# Altium schematic sheet ADC.SchDoc
size A4
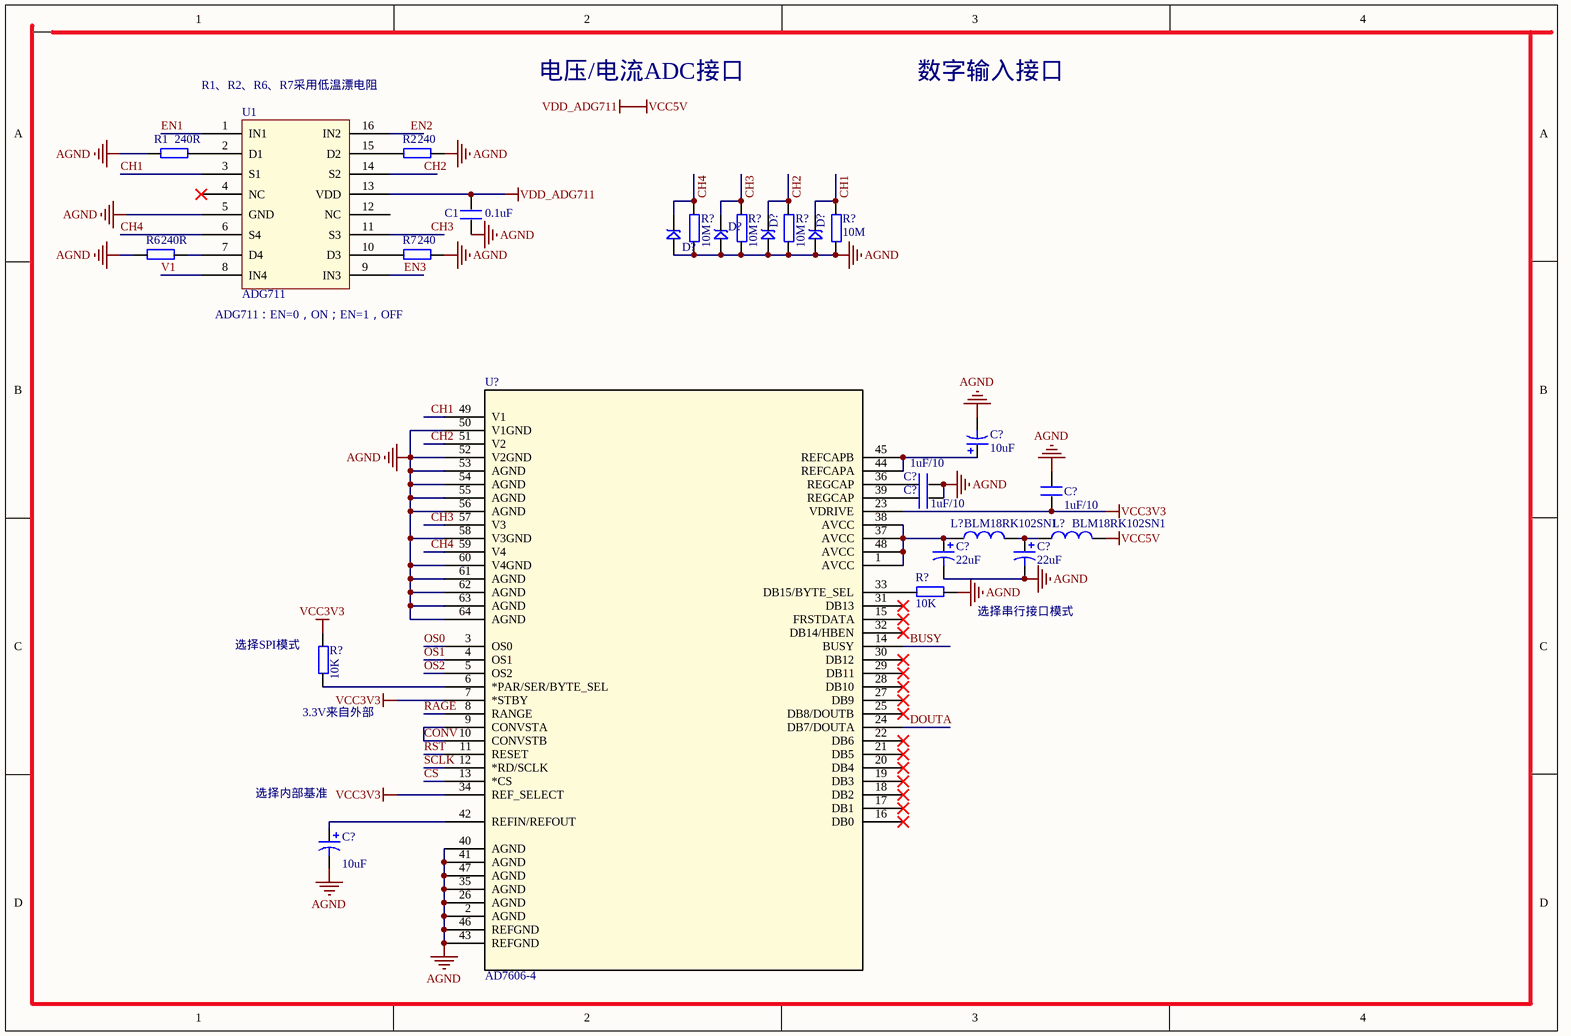
[diagram p0: ADC.SchDoc]

## Parts
(Parts that share a designator on the sheet are numbered #1, #2 ... from top to bottom, then left to right.)
C1  0.1uF  [0603]
C?#1  1uF/10  [0603]
C?#2  value 10uF  [CAP-3216]  (hidden comment: Cap Pol3)
C?#3  1uF/10  [0603]
C?#4  value 22uF  [CAP-3216]  (hidden comment: Cap Pol3)
C?#5  value 22uF  [CAP-3216]  (hidden comment: Cap Pol3)
C?#6  1uF/10  [0603]
C?#7  value 10uF  [CAP-3216]  (hidden comment: Cap Pol3)
D?#1  SMDJ 10CA  [SMC]  (value not drawn)
D?#2  SMDJ 10CA  [SMC]  (value not drawn)
D?#3  SMDJ 10CA  [SMC]  (value not drawn)
D?#4  SMDJ 10CA  [SMC]  (value not drawn)
L?#1  value BLM18RK102SN1  [0603-1]  (hidden comment: Inductor)
L?#2  value BLM18RK102SN1  [0603-1]  (hidden comment: Inductor)
R1  240R  [1206]
R2  240  [1206]
R6  240R  [1206]
R7  240  [1206]
R?#1  10M  [1206]
R?#2  10M  [1206]
R?#3  10M  [1206]
R?#4  10M  [1206]
R?#5  10K  [0603]
R?#6  10K  [0603]
U1  ADG711  [TSSOP16]
U?  AD7606-4  [ST_64_2]

## Nets
AGND: C1.1 C?#1.2 C?#2.2 C?#3.2 C?#4.2 C?#5.2 C?#6.2 C?#7.2 D?#1.1 D?#2.1 D?#3.1 D?#4.1 R1.2 R2.1 R6.2 R7.1 R?#1.1 R?#2.1 R?#3.1 R?#4.1 R?#5.1 U1.5(GND) U?.2(AGND) U?.26(AGND) U?.35(AGND) U?.40(AGND) U?.41(AGND) U?.43(REFGND) U?.46(REFGND) U?.47(AGND) U?.50(V1GND) U?.52(V2GND) U?.53(AGND) U?.54(AGND) U?.55(AGND) U?.56(AGND) U?.58(V3GND) U?.60(V4GND) U?.61(AGND) U?.62(AGND) U?.63(AGND) U?.64(AGND)
VCC3V3: C?#6.1 R?#6.2 U?.7(*STBY) U?.23(VDRIVE) U?.34(REF_SELECT)
VCC5V: C1.2 L?#2.2 U1.13(VDD)  [also labelled VDD_ADG711]
BUSY: U?.14(BUSY)
CH1: D?#4.2 R?#4.2 U1.3(S1) U?.49(V1)
CH2: D?#3.2 R?#3.2 U1.14(S2) U?.51(V2)
CH3: D?#2.2 R?#2.2 U1.11(S3) U?.57(V3)
CH4: D?#1.2 R?#1.2 U1.6(S4) U?.59(V4)
CONV: U?.9(CONVSTA) U?.10(CONVSTB)
CS: U?.13(*CS)
DOUTA: U?.24(DB7/DOUTA)
EN1: U1.1(IN1)
EN2: U1.16(IN2)
EN3: U1.9(IN3)
OS0: U?.3(OS0)
OS1: U?.4(OS1)
OS2: U?.5(OS2)
RAGE: U?.8(RANGE)
RST: U?.11(RESET)
SCLK: U?.12(*RD/SCLK)
V1: U1.8(IN4)
NetC?#1_1: C?#1.1 U?.36(REGCAP)
NetC?#2_1: C?#2.1 U?.44(REFCAPA) U?.45(REFCAPB)
NetC?#3_1: C?#3.1 U?.39(REGCAP)
NetC?#4_1: C?#4.1 L?#1.1 U?.1(AVCC) U?.37(AVCC) U?.38(AVCC) U?.48(AVCC)
NetC?#5_1: C?#5.1 L?#1.2 L?#2.1
NetC?#7_1: C?#7.1 U?.42(REFIN/REFOUT)
NetR1_1: R1.1 U1.2(D1)
NetR2_2: R2.2 U1.15(D2)
NetR6_1: R6.1 U1.7(D4)
NetR7_2: R7.2 U1.10(D3)
NetR?#5_2: R?#5.2 U?.33(DB15/BYTE_SEL)
NetR?#6_1: R?#6.1 U?.6(*PAR/SER/BYTE_SEL)

Not connected (* = marked no-connect by the designer): U1 4(NC)* 12(NC); U? 15(FRSTDATA)* 16(DB0)* 17(DB1)* 18(DB2)* 19(DB3)* 20(DB4)* 21(DB5)* 22(DB6)* 25(DB8/DOUTB)* 27(DB9)* 28(DB10)* 29(DB11)* 30(DB12)* 31(DB13)* 32(DB14/HBEN)*

## Notes on the sheet
- R1、R2、R6、R7采用低温漂电阻
- 电压/电流ADC接口
- 数字输入接口
- (near U1) ADG711：EN=0，ON；EN=1，OFF
- (near R?#6) 选择SPI模式
- 选择串行接口模式
- (near R?#6) 3.3V来自外部
- 选择内部基准

## Library data of the parts
C1 C?#1 C?#3 C?#6 = C
C?#2 C?#4 C?#5 C?#7 = Cap Pol3: Polarized Capacitor (Surface Mount); Published: 8-Jun-2000; LatestRevisionDate: 29-May-2009; LatestRevisionNote: IPC-7351 Footprint Added.; PackageReference: C0805; Publisher: Altium Limited; PackageDescription: Chip Capacitor
D?#1-D?#4 = SMBJ 6.5CA: TVS,SMBJ 6.5CA,600W SMD Transient Voltage Suppressor Diodes,; Terabits Part Number: 1D-0000001-XX; Manufacture: LRC; Part Type: Diode; Manufacture Part Number: SMBJ 6.5CA
L?#1 L?#2 = Inductor: 电感; Code_IEC: 1005; Published: 8-Jun-2000; LatestRevisionDate: 17-Jul-2002; LatestRevisionNote: Re-released for DXP Platform.; PackageReference: 0402-A; Publisher: Altium Limited; Code_JEITA: 0402
R1 R2 R6 R7 R?#1-R?#6 = R
U? = AD7606BSTZ: Imported; Value: Value; Type: Type; RefDes: RefDes